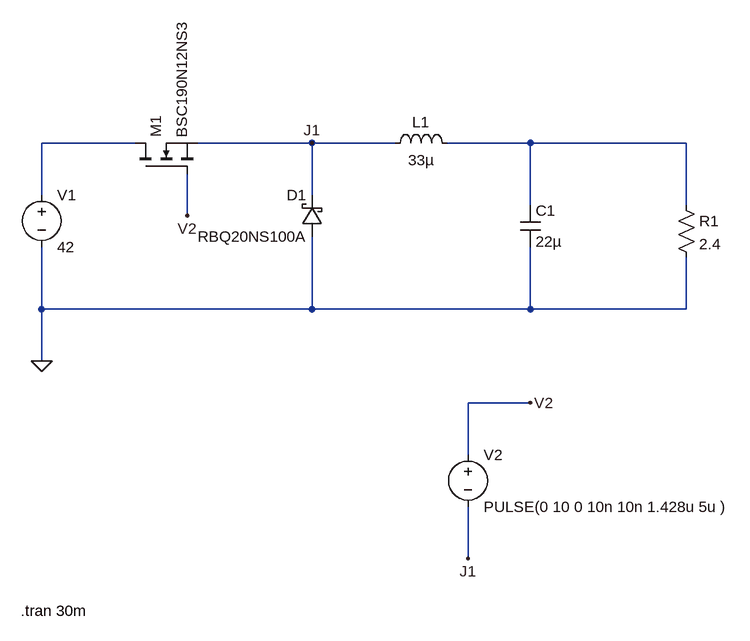
[diagram p0: schematic 60W Buck converter ideal case.asc]
60W Buck converter ideal case.asc, the LTspice schematic file:
Version 4.1
SHEET 1 1160 752
WIRE 144 16 0 16
WIRE 416 16 240 16
WIRE 544 16 416 16
WIRE 752 16 624 16
WIRE 992 16 752 16
WIRE 0 96 0 16
WIRE 416 96 416 16
WIRE 752 112 752 16
WIRE 992 112 992 16
WIRE 224 128 224 64
WIRE 0 272 0 176
WIRE 416 272 416 160
WIRE 416 272 0 272
WIRE 752 272 752 176
WIRE 752 272 416 272
WIRE 992 272 992 192
WIRE 992 272 752 272
WIRE 0 352 0 272
WIRE 752 416 656 416
WIRE 656 496 656 416
WIRE 656 656 656 576
FLAG 224 128 V2
FLAG 0 352 0
FLAG 416 16 J1
FLAG 656 656 J1
FLAG 752 416 V2
SYMBOL voltage 0 80 R0
WINDOW 123 0 0 Left 0
WINDOW 39 0 0 Left 0
SYMATTR InstName V1
SYMATTR Value 42
SYMBOL cap 736 112 R0
SYMATTR InstName C1
SYMATTR Value 22µ
SYMBOL res 976 96 R0
SYMATTR InstName R1
SYMATTR Value 2.4
SYMBOL schottky 432 160 R180
WINDOW 0 24 64 Left 2
WINDOW 3 24 0 Left 2
SYMATTR InstName D1
SYMATTR Value RBQ20NS100A
SYMBOL nmos 144 64 R270
SYMATTR InstName M1
SYMATTR Value BSC190N12NS3
SYMBOL voltage 656 480 R0
WINDOW 123 0 0 Left 0
WINDOW 39 0 0 Left 0
SYMATTR InstName V2
SYMATTR Value PULSE(0 10 0 10n 10n 1.428u 5u )
SYMBOL ind 528 32 R270
WINDOW 0 32 56 VTop 2
WINDOW 3 5 56 VBottom 2
SYMATTR InstName L1
SYMATTR Value 33µ
SYMATTR SpiceLine Rser=1m
TEXT -32 736 Left 2 !.tran 30m

The netlist it stands for:
* 60W Buck converter ideal case.asc
V1 N001 0 42
C1 N002 0 22µ
R1 N002 0 2.4
D1 0 J1 RBQ20NS100A
M1 N001 V2 J1 J1 BSC190N12NS3
V2 V2 J1 PULSE(0 10 0 10n 10n 1.428u 5u )
L1 J1 N002 33µ Rser=1m
.model D D
.lib standard.dio
.model NMOS NMOS
.model PMOS PMOS
.lib standard.mos
.tran 30m
.backanno
.end